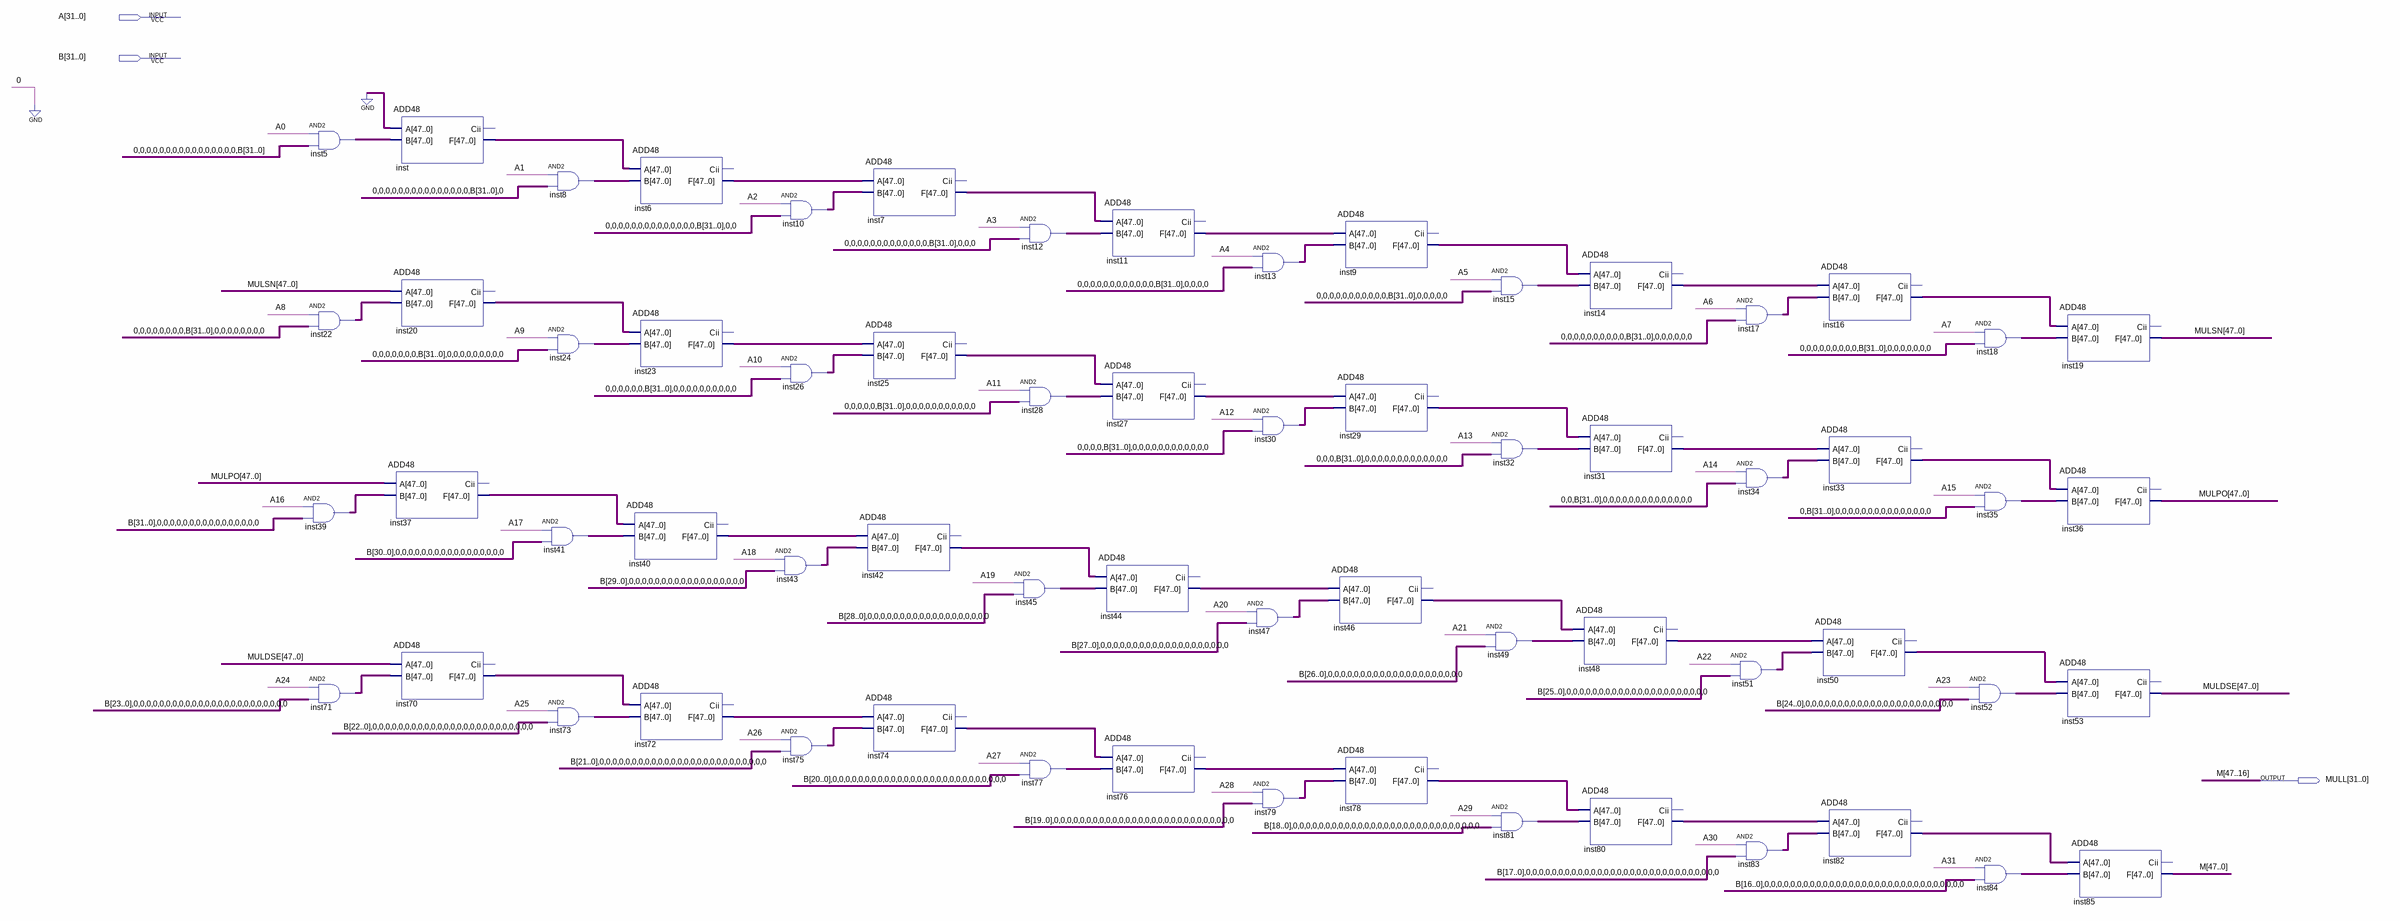
[diagram p0: schematic sheet]
// Quartus schematic MUL32.bdf as structural Verilog: 64 symbols, 3 pins
module MUL32 (
  input  [31:0] A,
  input  [31:0] B,
  output [31:0] MULL
);

  wire [15:0] M;
  wire [47:0] inst5_out, inst6_f, inst7_f, inst8_out, inst9_f, inst10_out, inst11_f, inst12_out, inst13_out,
       inst14_f, inst15_out, inst16_f, inst17_out, inst18_out, inst20_f, inst22_out, inst23_f, inst24_out,
       inst25_f, inst26_out, inst27_f, inst28_out, inst29_f, inst30_out, inst31_f, inst32_out, inst33_f,
       inst34_out, inst35_out, inst37_f, inst39_out, inst40_f, inst41_out, inst42_f, inst43_out, inst44_f,
       inst45_out, inst46_f, inst47_out, inst48_f, inst49_out, inst50_f, inst51_out, inst52_out, inst70_f,
       inst71_out, inst72_f, inst73_out, inst74_f, inst75_out, inst76_f, inst77_out, inst78_f, inst79_out,
       inst80_f, inst81_out, inst82_f, inst83_out, inst84_out, inst_f, MULDSE, MULPO, MULSN;

  assign inst5_out = {48{A[0]}} & {{16{1'b0}}, B};  // AND2 inst5, 48 bits wide
  assign inst22_out = {48{A[8]}} & {{8{1'b0}}, B, {8{1'b0}}};  // AND2 inst22, 48 bits wide
  assign inst39_out = {48{A[16]}} & {B, {16{1'b0}}};  // AND2 inst39, 48 bits wide
  assign inst71_out = {48{A[24]}} & {B[23:0], {24{1'b0}}};  // AND2 inst71, 48 bits wide
  ADD48 inst (.A({48{1'b0}}), .B(inst5_out), .F(inst_f));  // open: Cii
  ADD48 inst20 (.A(MULSN), .B(inst22_out), .F(inst20_f));  // open: Cii
  ADD48 inst37 (.A(MULPO), .B(inst39_out), .F(inst37_f));  // open: Cii
  ADD48 inst70 (.A(MULDSE), .B(inst71_out), .F(inst70_f));  // open: Cii
  assign inst41_out = {48{A[17]}} & {B[30:0], {17{1'b0}}};  // AND2 inst41, 48 bits wide
  assign inst8_out = {48{A[1]}} & {{15{1'b0}}, B, 1'b0};  // AND2 inst8, 48 bits wide
  assign inst24_out = {48{A[9]}} & {{7{1'b0}}, B, {9{1'b0}}};  // AND2 inst24, 48 bits wide
  assign inst73_out = {48{A[25]}} & {B[22:0], {25{1'b0}}};  // AND2 inst73, 48 bits wide
  ADD48 inst6 (.A(inst_f), .B(inst8_out), .F(inst6_f));  // open: Cii
  ADD48 inst23 (.A(inst20_f), .B(inst24_out), .F(inst23_f));  // open: Cii
  ADD48 inst40 (.A(inst37_f), .B(inst41_out), .F(inst40_f));  // open: Cii
  ADD48 inst72 (.A(inst70_f), .B(inst73_out), .F(inst72_f));  // open: Cii
  assign inst43_out = {48{A[18]}} & {B[29:0], {18{1'b0}}};  // AND2 inst43, 48 bits wide
  assign inst10_out = {48{A[2]}} & {{14{1'b0}}, B, 2'b00};  // AND2 inst10, 48 bits wide
  assign inst26_out = {48{A[10]}} & {{6{1'b0}}, B, {10{1'b0}}};  // AND2 inst26, 48 bits wide
  assign inst75_out = {48{A[26]}} & {B[21:0], {26{1'b0}}};  // AND2 inst75, 48 bits wide
  ADD48 inst7 (.A(inst6_f), .B(inst10_out), .F(inst7_f));  // open: Cii
  ADD48 inst25 (.A(inst23_f), .B(inst26_out), .F(inst25_f));  // open: Cii
  ADD48 inst42 (.A(inst40_f), .B(inst43_out), .F(inst42_f));  // open: Cii
  ADD48 inst74 (.A(inst72_f), .B(inst75_out), .F(inst74_f));  // open: Cii
  assign inst12_out = {48{A[3]}} & {{13{1'b0}}, B, 3'b000};  // AND2 inst12, 48 bits wide
  assign inst28_out = {48{A[11]}} & {{5{1'b0}}, B, {11{1'b0}}};  // AND2 inst28, 48 bits wide
  assign inst45_out = {48{A[19]}} & {B[28:0], {19{1'b0}}};  // AND2 inst45, 48 bits wide
  assign inst77_out = {48{A[27]}} & {B[20:0], {27{1'b0}}};  // AND2 inst77, 48 bits wide
  ADD48 inst11 (.A(inst7_f), .B(inst12_out), .F(inst11_f));  // open: Cii
  ADD48 inst27 (.A(inst25_f), .B(inst28_out), .F(inst27_f));  // open: Cii
  ADD48 inst44 (.A(inst42_f), .B(inst45_out), .F(inst44_f));  // open: Cii
  ADD48 inst76 (.A(inst74_f), .B(inst77_out), .F(inst76_f));  // open: Cii
  assign inst13_out = {48{A[4]}} & {{12{1'b0}}, B, 4'b0000};  // AND2 inst13, 48 bits wide
  assign inst30_out = {48{A[12]}} & {4'b0000, B, {12{1'b0}}};  // AND2 inst30, 48 bits wide
  assign inst47_out = {48{A[20]}} & {B[27:0], {20{1'b0}}};  // AND2 inst47, 48 bits wide
  assign inst79_out = {48{A[28]}} & {B[19:0], {28{1'b0}}};  // AND2 inst79, 48 bits wide
  ADD48 inst9 (.A(inst11_f), .B(inst13_out), .F(inst9_f));  // open: Cii
  ADD48 inst29 (.A(inst27_f), .B(inst30_out), .F(inst29_f));  // open: Cii
  ADD48 inst46 (.A(inst44_f), .B(inst47_out), .F(inst46_f));  // open: Cii
  ADD48 inst78 (.A(inst76_f), .B(inst79_out), .F(inst78_f));  // open: Cii
  assign inst15_out = {48{A[5]}} & {{11{1'b0}}, B, {5{1'b0}}};  // AND2 inst15, 48 bits wide
  assign inst32_out = {48{A[13]}} & {3'b000, B, {13{1'b0}}};  // AND2 inst32, 48 bits wide
  assign inst49_out = {48{A[21]}} & {B[26:0], {21{1'b0}}};  // AND2 inst49, 48 bits wide
  assign inst81_out = {48{A[29]}} & {B[18:0], {29{1'b0}}};  // AND2 inst81, 48 bits wide
  ADD48 inst14 (.A(inst9_f), .B(inst15_out), .F(inst14_f));  // open: Cii
  ADD48 inst31 (.A(inst29_f), .B(inst32_out), .F(inst31_f));  // open: Cii
  ADD48 inst48 (.A(inst46_f), .B(inst49_out), .F(inst48_f));  // open: Cii
  ADD48 inst80 (.A(inst78_f), .B(inst81_out), .F(inst80_f));  // open: Cii
  assign inst17_out = {48{A[6]}} & {{10{1'b0}}, B, {6{1'b0}}};  // AND2 inst17, 48 bits wide
  assign inst34_out = {48{A[14]}} & {2'b00, B, {14{1'b0}}};  // AND2 inst34, 48 bits wide
  assign inst51_out = {48{A[22]}} & {B[25:0], {22{1'b0}}};  // AND2 inst51, 48 bits wide
  assign inst83_out = {48{A[30]}} & {B[17:0], {30{1'b0}}};  // AND2 inst83, 48 bits wide
  ADD48 inst16 (.A(inst14_f), .B(inst17_out), .F(inst16_f));  // open: Cii
  ADD48 inst33 (.A(inst31_f), .B(inst34_out), .F(inst33_f));  // open: Cii
  ADD48 inst50 (.A(inst48_f), .B(inst51_out), .F(inst50_f));  // open: Cii
  ADD48 inst82 (.A(inst80_f), .B(inst83_out), .F(inst82_f));  // open: Cii
  assign inst18_out = {48{A[7]}} & {{9{1'b0}}, B, {7{1'b0}}};  // AND2 inst18, 48 bits wide
  assign inst35_out = {48{A[15]}} & {1'b0, B, {15{1'b0}}};  // AND2 inst35, 48 bits wide
  assign inst52_out = {48{A[23]}} & {B[24:0], {23{1'b0}}};  // AND2 inst52, 48 bits wide
  assign inst84_out = {48{A[31]}} & {B[16:0], {31{1'b0}}};  // AND2 inst84, 48 bits wide
  ADD48 inst19 (.A(inst16_f), .B(inst18_out), .F(MULSN));  // open: Cii
  ADD48 inst36 (.A(inst33_f), .B(inst35_out), .F(MULPO));  // open: Cii
  ADD48 inst53 (.A(inst50_f), .B(inst52_out), .F(MULDSE));  // open: Cii
  ADD48 inst85 (.A(inst82_f), .B(inst84_out), .F({MULL, M}));  // open: Cii

  // Other names for the same wires on the sheet: M[47:16] = MULL
endmodule
